# EAGLE design Selecta Pi Shield V1 (EAGLE 9.3.1)

## Sheet 1 of 3
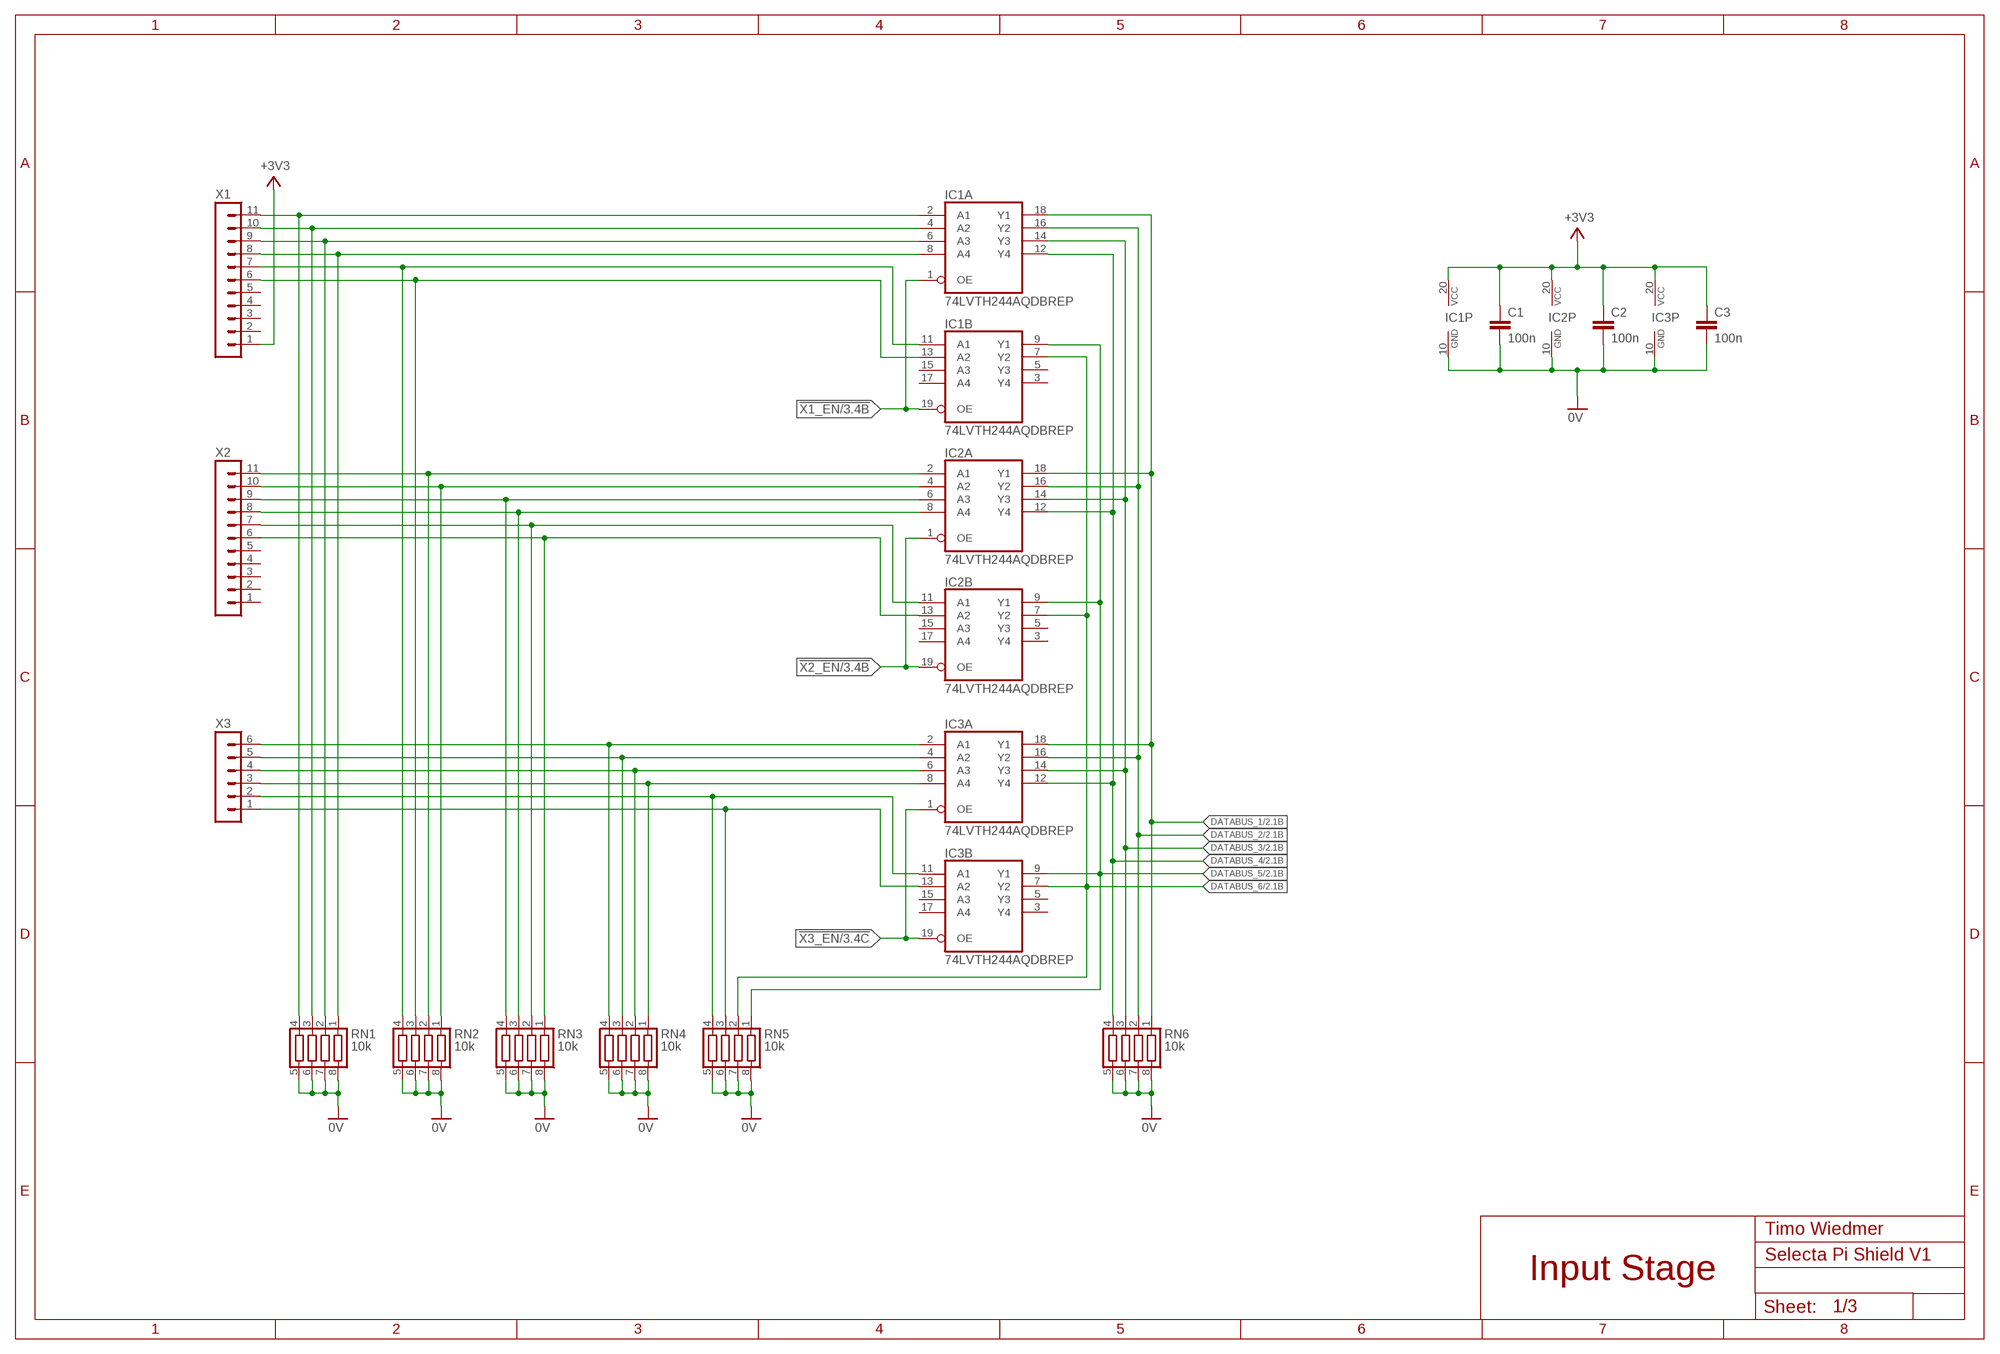
[diagram p0: schematic, sheet 1]

### Parts
C1  100n  C-EUC0603  [C0603]
C2  100n  C-EUC0603  [C0603]
C3  100n  C-EUC0603  [C0603]
IC1  74LVTH244AQDBREP  74244AQDBREP  [SSOP20]
IC2  74LVTH244AQDBREP  74244AQDBREP  [SSOP20]
IC3  74LVTH244AQDBREP  74244AQDBREP  [SSOP20]
RN1  10k  CTS742C083  [CTS742C083]
RN2  10k  CTS742C083  [CTS742C083]
RN3  10k  CTS742C083  [CTS742C083]
RN4  10k  CTS742C083  [CTS742C083]
RN5  10k  CTS742C083  [CTS742C083]
RN6  10k  CTS742C083  [CTS742C083]
X1  MA11-1  [MA11-1]
X2  MA11-1  [MA11-1]
X3  MA06-1  [MA06-1]

### Nets
0V: C1.2 C2.2 C3.2 IC1.10(P:GND) IC2.10(P:GND) IC3.10(P:GND) RN1.5 RN1.6 RN1.7 RN1.8 RN2.5 RN2.6 RN2.7 RN2.8 RN3.5 RN3.6 RN3.7 RN3.8 RN4.5 RN4.6 RN4.7 RN4.8 RN5.5 RN5.6 RN5.7 RN5.8 RN6.5 RN6.6 RN6.7 RN6.8 ; also sheet 2,3
!X1_EN: IC1.1(A:OE) IC1.19(B:OE) ; also sheet 3
!X2_EN: IC2.1(A:OE) IC2.19(B:OE) ; also sheet 3
!X3_EN: IC3.1(A:OE) IC3.19(B:OE) ; also sheet 3
+3V3: C1.1 C2.1 C3.1 IC1.20(P:VCC) IC2.20(P:VCC) IC3.20(P:VCC) X1.1 ; also sheet 3
DATABUS_1: IC1.18(A:Y1) IC2.18(A:Y1) IC3.18(A:Y1) RN6.1 ; also sheet 2,3
DATABUS_2: IC1.16(A:Y2) IC2.16(A:Y2) IC3.16(A:Y2) RN6.2 ; also sheet 2,3
DATABUS_3: IC1.14(A:Y3) IC2.14(A:Y3) IC3.14(A:Y3) RN6.3 ; also sheet 2,3
DATABUS_4: IC1.12(A:Y4) IC2.12(A:Y4) IC3.12(A:Y4) RN6.4 ; also sheet 2,3
DATABUS_5: IC1.9(B:Y1) IC2.9(B:Y1) IC3.9(B:Y1) RN5.1 ; also sheet 2,3
DATABUS_6: IC1.7(B:Y2) IC2.7(B:Y2) IC3.7(B:Y2) RN5.2 ; also sheet 2,3
N$1: IC1.2(A:A1) RN1.4 X1.11
N$2: IC1.4(A:A2) RN1.3 X1.10
N$3: IC1.6(A:A3) RN1.2 X1.9
N$4: IC1.8(A:A4) RN1.1 X1.8
N$5: IC2.2(A:A1) RN2.2 X2.11
N$6: IC2.4(A:A2) RN2.1 X2.10
N$7: IC2.6(A:A3) RN3.4 X2.9
N$8: IC2.8(A:A4) RN3.3 X2.8
N$9: IC3.2(A:A1) RN4.4 X3.6
N$10: IC3.4(A:A2) RN4.3 X3.5
N$11: IC1.11(B:A1) RN2.4 X1.7
N$12: IC1.13(B:A2) RN2.3 X1.6
N$13: IC2.11(B:A1) RN3.2 X2.7
N$14: IC3.6(A:A3) RN4.2 X3.4
N$15: IC2.13(B:A2) RN3.1 X2.6
N$16: IC3.8(A:A4) RN4.1 X3.3
N$17: IC3.11(B:A1) RN5.4 X3.2
N$18: IC3.13(B:A2) RN5.3 X3.1
Unconnected: IC1.3(B:Y4) IC1.5(B:Y3) IC1.15(B:A3) IC1.17(B:A4) IC2.3(B:Y4) IC2.5(B:Y3) IC2.15(B:A3) IC2.17(B:A4) IC3.3(B:Y4) IC3.5(B:Y3) IC3.15(B:A3) IC3.17(B:A4) X1.2 X1.3 X1.4 X1.5 X2.1 X2.2 X2.3 X2.4 X2.5

### Notes on the sheet
- Timo Wiedmer
- Input Stage

## Sheet 2 of 3
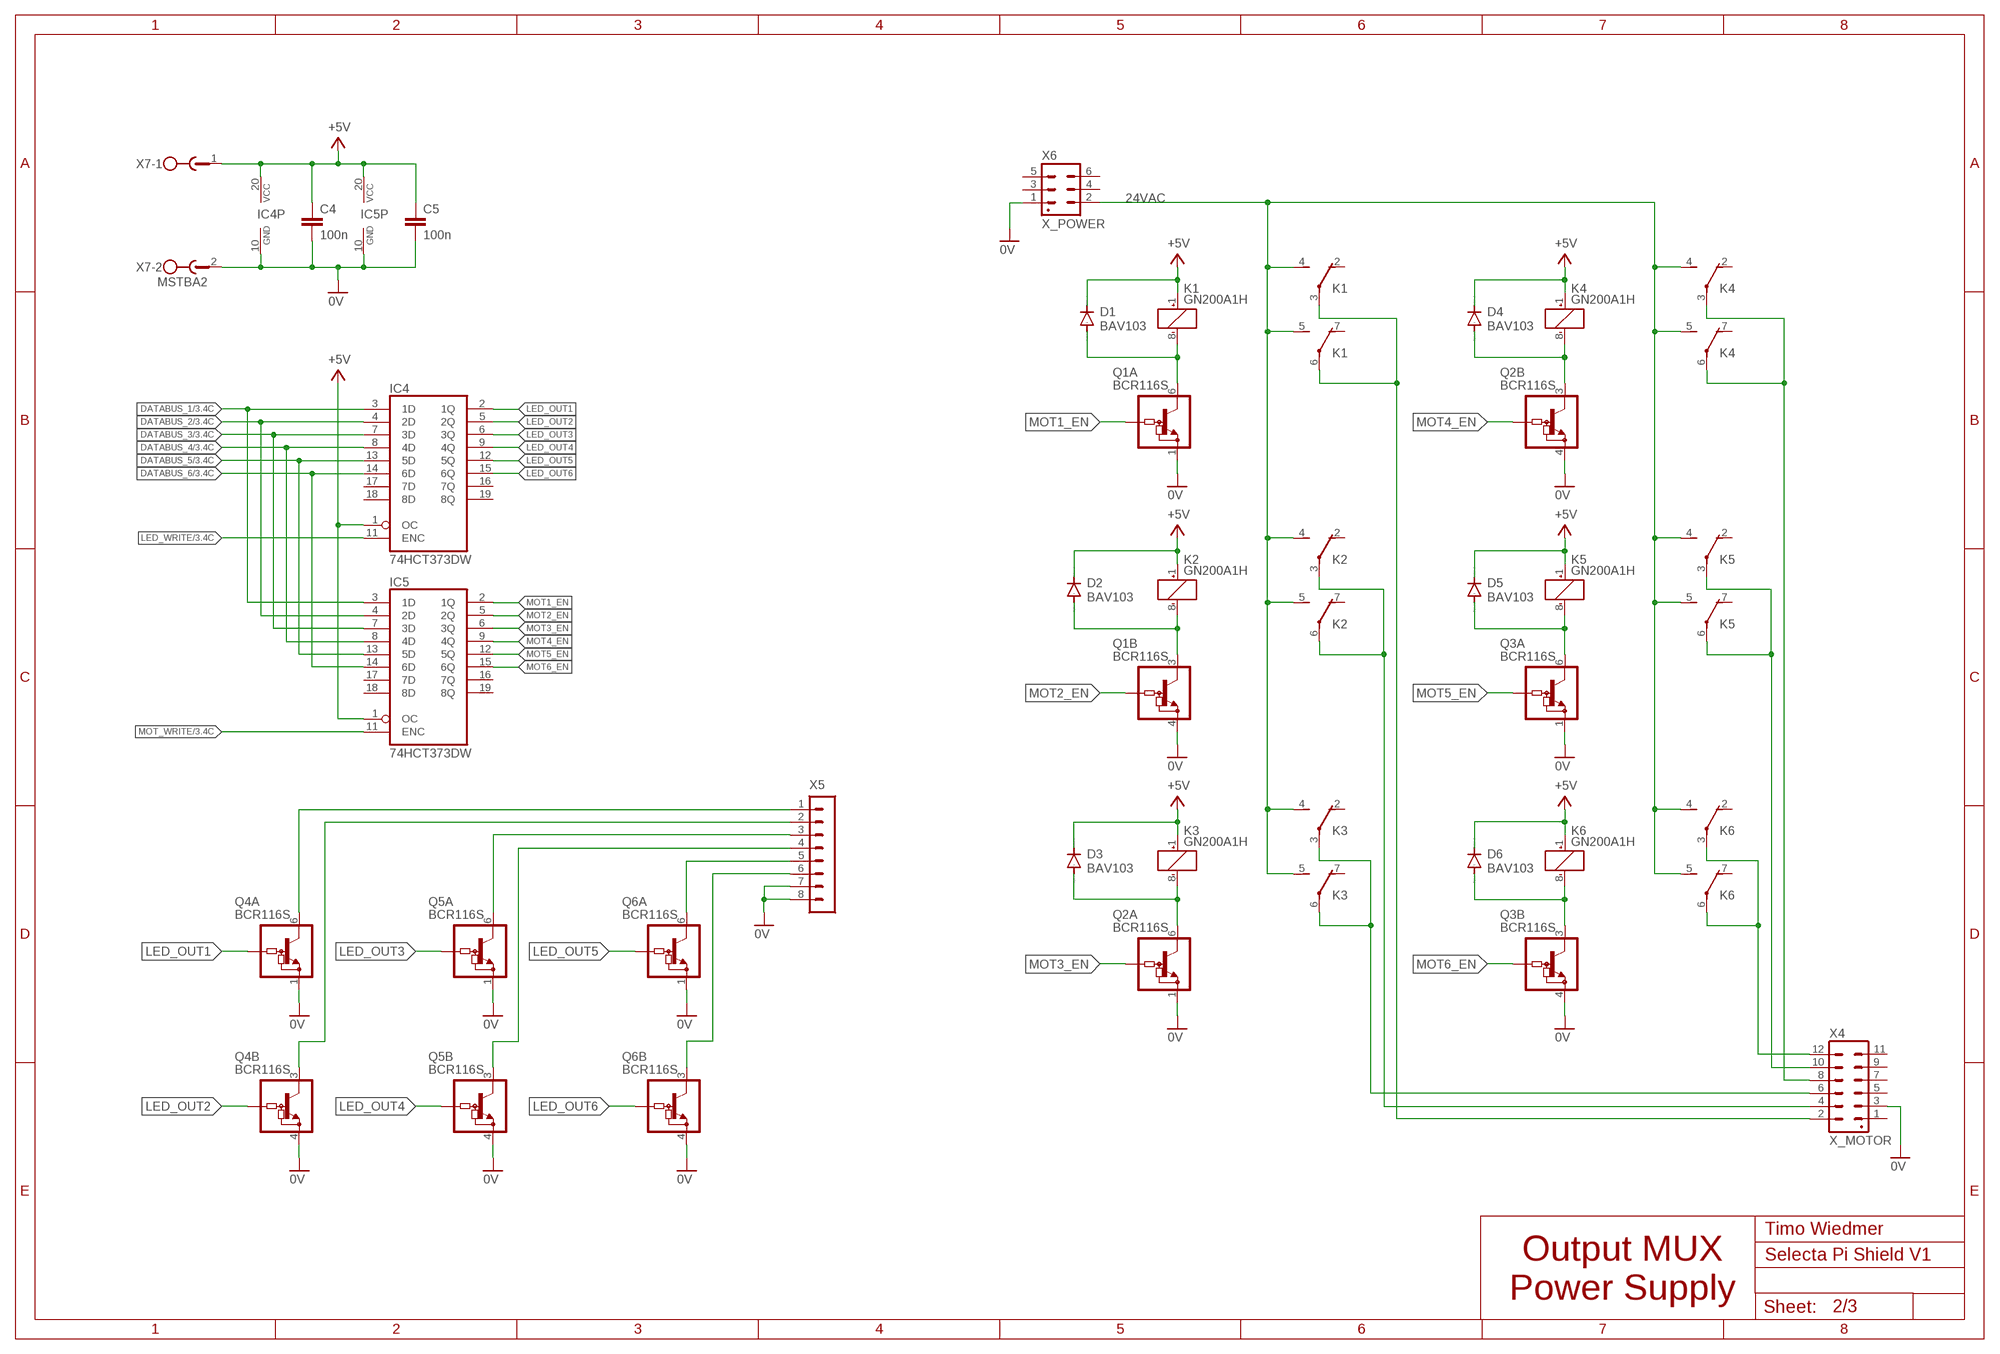
[diagram p1: schematic, sheet 2]

### Parts
C4  100n  C-EUC0603  [C0603]
C5  100n  C-EUC0603  [C0603]
D1  BAV103  [SOD-123_MINI-SMA]
D2  BAV103  [SOD-123_MINI-SMA]
D3  BAV103  [SOD-123_MINI-SMA]
D4  BAV103  [SOD-123_MINI-SMA]
D5  BAV103  [SOD-123_MINI-SMA]
D6  BAV103  [SOD-123_MINI-SMA]
IC4  74HCT373DW  [SO20W]
IC5  74HCT373DW  [SO20W]
K1  GN200A1H  [GN-A]
K2  GN200A1H  [GN-A]
K3  GN200A1H  [GN-A]
K4  GN200A1H  [GN-A]
K5  GN200A1H  [GN-A]
K6  GN200A1H  [GN-A]
Q1  BCR116S  [SOT363]
Q2  BCR116S  [SOT363]
Q3  BCR116S  [SOT363]
Q4  BCR116S  [SOT363]
Q5  BCR116S  [SOT363]
Q6  BCR116S  [SOT363]
X4  X_MOTOR  12P_MINI_FIT  [12P_MINI_FIT]
X5  MA08-1  [MA08-1]
X6  X_POWER  6P_MINI_FIT  [6P_MINI_FIT]
X7  MSTBA2  [MSTBA2]

### Nets
0V: C4.2 C5.2 IC4.10(GND) IC5.10(GND) Q1.1(A:E) Q1.4(B:E) Q2.1(A:E) Q2.4(B:E) Q3.1(A:E) Q3.4(B:E) Q4.1(A:E) Q4.4(B:E) Q5.1(A:E) Q5.4(B:E) Q6.1(A:E) Q6.4(B:E) X4.3 X5.7 X5.8 X6.1 X7.2 ; also sheet 1,3
24VAC: K1.4(S:S) K1.5(T:S) K2.4(S:S) K2.5(T:S) K3.4(S:S) K3.5(T:S) K4.4(S:S) K4.5(T:S) K5.4(S:S) K5.5(T:S) K6.4(S:S) K6.5(T:S) X6.2
24VAC_MOT1: K1.3(S:P) K1.6(T:P) X4.2
24VAC_MOT2: K2.3(S:P) K2.6(T:P) X4.4
24VAC_MOT3: K3.3(S:P) K3.6(T:P) X4.6
24VAC_MOT4: K4.3(S:P) K4.6(T:P) X4.8
24VAC_MOT5: K5.3(S:P) K5.6(T:P) X4.10
24VAC_MOT6: K6.3(S:P) K6.6(T:P) X4.12
+5V: C4.1 C5.1 D1.C D2.C D3.C D4.C D5.C D6.C IC4.1(OC) IC4.20(VCC) IC5.1(OC) IC5.20(VCC) K1.1(R:+) K2.1(R:+) K3.1(R:+) K4.1(R:+) K5.1(R:+) K6.1(R:+) X7.1 ; also sheet 3
DATABUS_1: IC4.3(1D) IC5.3(1D) ; also sheet 1,3
DATABUS_2: IC4.4(2D) IC5.4(2D) ; also sheet 1,3
DATABUS_3: IC4.7(3D) IC5.7(3D) ; also sheet 1,3
DATABUS_4: IC4.8(4D) IC5.8(4D) ; also sheet 1,3
DATABUS_5: IC4.13(5D) IC5.13(5D) ; also sheet 1,3
DATABUS_6: IC4.14(6D) IC5.14(6D) ; also sheet 1,3
LED_OUT1: IC4.2(1Q) Q4.2(A:B)
LED_OUT2: IC4.5(2Q) Q4.5(B:B)
LED_OUT3: IC4.6(3Q) Q5.2(A:B)
LED_OUT4: IC4.9(4Q) Q5.5(B:B)
LED_OUT5: IC4.12(5Q) Q6.2(A:B)
LED_OUT6: IC4.15(6Q) Q6.5(B:B)
LED_WRITE: IC4.11(ENC) ; also sheet 3
MOT1_EN: IC5.2(1Q) Q1.2(A:B)
MOT2_EN: IC5.5(2Q) Q1.5(B:B)
MOT3_EN: IC5.6(3Q) Q2.2(A:B)
MOT4_EN: IC5.9(4Q) Q2.5(B:B)
MOT5_EN: IC5.12(5Q) Q3.2(A:B)
MOT6_EN: IC5.15(6Q) Q3.5(B:B)
MOT_WRITE: IC5.11(ENC) ; also sheet 3
N$19: Q4.6(A:C) X5.1
N$26: Q4.3(B:C) X5.2
N$27: D3.A K3.8(R:-) Q2.6(A:C)
N$28: D6.A K6.8(R:-) Q3.3(B:C)
N$29: D5.A K5.8(R:-) Q3.6(A:C)
N$30: D2.A K2.8(R:-) Q1.3(B:C)
N$31: D1.A K1.8(R:-) Q1.6(A:C)
N$32: D4.A K4.8(R:-) Q2.3(B:C)
N$33: Q5.6(A:C) X5.3
N$34: Q5.3(B:C) X5.4
N$35: Q6.6(A:C) X5.5
N$36: Q6.3(B:C) X5.6
Unconnected: IC4.16(7Q) IC4.17(7D) IC4.18(8D) IC4.19(8Q) IC5.16(7Q) IC5.17(7D) IC5.18(8D) IC5.19(8Q) K1.2(S:O) K1.7(T:O) K2.2(S:O) K2.7(T:O) K3.2(S:O) K3.7(T:O) K4.2(S:O) K4.7(T:O) K5.2(S:O) K5.7(T:O) K6.2(S:O) K6.7(T:O) X4.1 X4.5 X4.7 X4.9 X4.11 X6.3 X6.4 X6.5 X6.6

### Notes on the sheet
- Timo Wiedmer
- Output MUX
  Power Supply

## Sheet 3 of 3
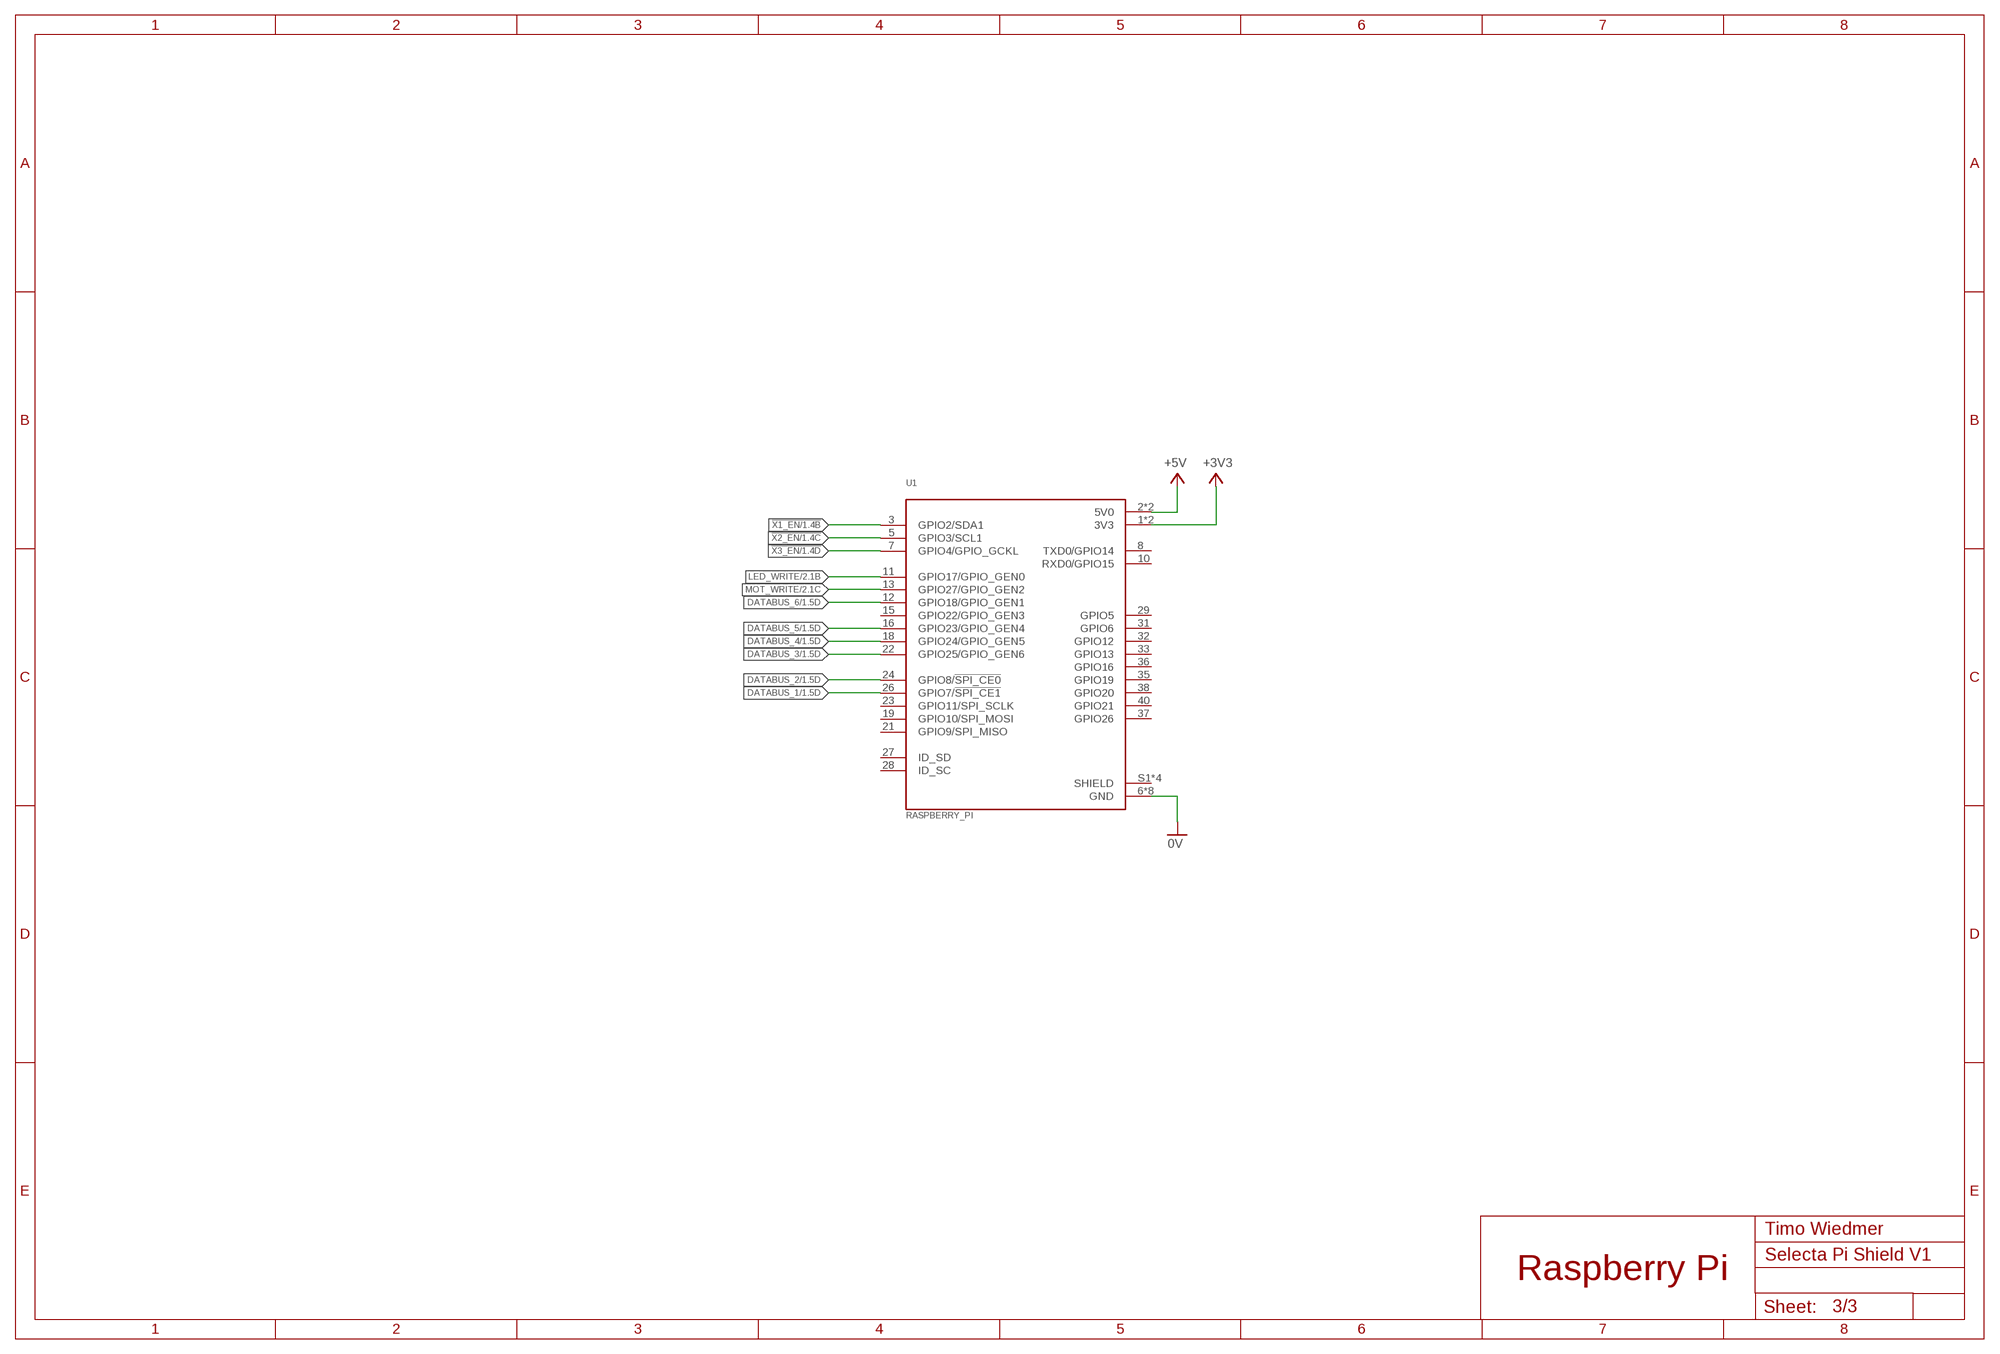
[diagram p2: schematic, sheet 3]

### Parts
U1  RASPBERRY_PI  [RASPBERRY_PI]

### Nets
0V: U1.6(GND) U1.9(GND) U1.14(GND) U1.20(GND) U1.25(GND) U1.30(GND) U1.34(GND) U1.39(GND) ; also sheet 1,2
!X1_EN: U1.3(GPIO2/SDA1) ; also sheet 1
!X2_EN: U1.5(GPIO3/SCL1) ; also sheet 1
!X3_EN: U1.7(GPIO4/GPIO_GCKL) ; also sheet 1
+3V3: U1.1(3V3) U1.17(3V3) ; also sheet 1
+5V: U1.2(5V0) U1.4(5V0) ; also sheet 2
DATABUS_1: U1.26(GPIO7/!SPI_CE1!) ; also sheet 1,2
DATABUS_2: U1.24(GPIO8/!SPI_CE0!) ; also sheet 1,2
DATABUS_3: U1.22(GPIO25/GPIO_GEN6) ; also sheet 1,2
DATABUS_4: U1.18(GPIO24/GPIO_GEN5) ; also sheet 1,2
DATABUS_5: U1.16(GPIO23/GPIO_GEN4) ; also sheet 1,2
DATABUS_6: U1.12(GPIO18/GPIO_GEN1) ; also sheet 1,2
LED_WRITE: U1.11(GPIO17/GPIO_GEN0) ; also sheet 2
MOT_WRITE: U1.13(GPIO27/GPIO_GEN2) ; also sheet 2
Unconnected: U1.8(TXD0/GPIO14) U1.10(RXD0/GPIO15) U1.15(GPIO22/GPIO_GEN3) U1.19(GPIO10/SPI_MOSI) U1.21(GPIO9/SPI_MISO) U1.23(GPIO11/SPI_SCLK) U1.27(ID_SD) U1.28(ID_SC) U1.29(GPIO5) U1.31(GPIO6) U1.32(GPIO12) U1.33(GPIO13) U1.35(GPIO19) U1.36(GPIO16) U1.37(GPIO26) U1.38(GPIO20) U1.40(GPIO21)

### Notes on the sheet
- Timo Wiedmer
- Raspberry Pi

## Power pins joined to a net without a drawn wire
SHIELD: U1.S1(SHIELD) U1.S2(SHIELD) U1.S3(SHIELD) U1.S4(SHIELD)

## Library data of the parts
C1-C5 = rcl:C-EU: CAPACITOR, European symbol; SPICEPREFIX: C
D1-D6 = Selecta Pi Shield Parts:BAV103
IC1-IC3 = Selecta Pi Shield Parts:74*244: Octal BUFFER and LINE DRIVER, 3-state
IC4 IC5 = 74xx-eu:74*373: Octal D type transparent LATCH, edge triggered
K1-K6 = relay:GN?*: ULTRA-SMALL PACKAGE SLIM POLARIZED RELAY NAiS Source: http://www.mew-europe.com/.. en_ds_61007_0000.pdf; OC_FARNELL: unknown; OC_NEWARK: unknown
Q1-Q6 = Selecta Pi Shield Parts:BCR116
RN1-RN6 = resistor-net:CTS742C083: Chip Resistor Array 4 Single Resistor Source: http://www.ctscorp.com/components/Datasheets/CTSChipArrayDs.pdf; OC_FARNELL: unknown; OC_NEWARK: unknown
U1 = Selecta Pi Shield Parts:RASPBERRY_PI: BCM2835 Raspberry Pi Model B+ - ARM11, VideoCore MPU Embedded Evaluation Board Check availability <https://pricing.snapeda.com/parts/RASPBERRY%20PI%203%20MODEL%20B%2B/Raspberry%20Pi/view-part?ref=eda>; AVAILABILITY: Not in stock; DESCRIPTION: RASPBERRY PI 3 MOD B+ BCM2837B0; MF: Raspberry Pi; MP: RASPBERRY PI 3 MODEL B+; PACKAGE: None; PRICE: None
X1 X2 = Selecta Pi Shield Parts:MA11-1
X3 = Selecta Pi Shield Parts:MA06-1: PIN HEADER; OC_FARNELL: unknown; OC_NEWARK: unknown
X4 = Selecta Pi Shield Parts:12P_MINI_FIT
X5 = Selecta Pi Shield Parts:MA08-1: PIN HEADER; OC_FARNELL: unknown; OC_NEWARK: unknown
X6 = Selecta Pi Shield Parts:6P_MINI_FIT
X7 = con-phoenix-508:MSTBA2: PHOENIX; MF: FARNELL; MPN: 1757242; OC_FARNELL: 3705171; OC_NEWARK: 71C4161

## Board
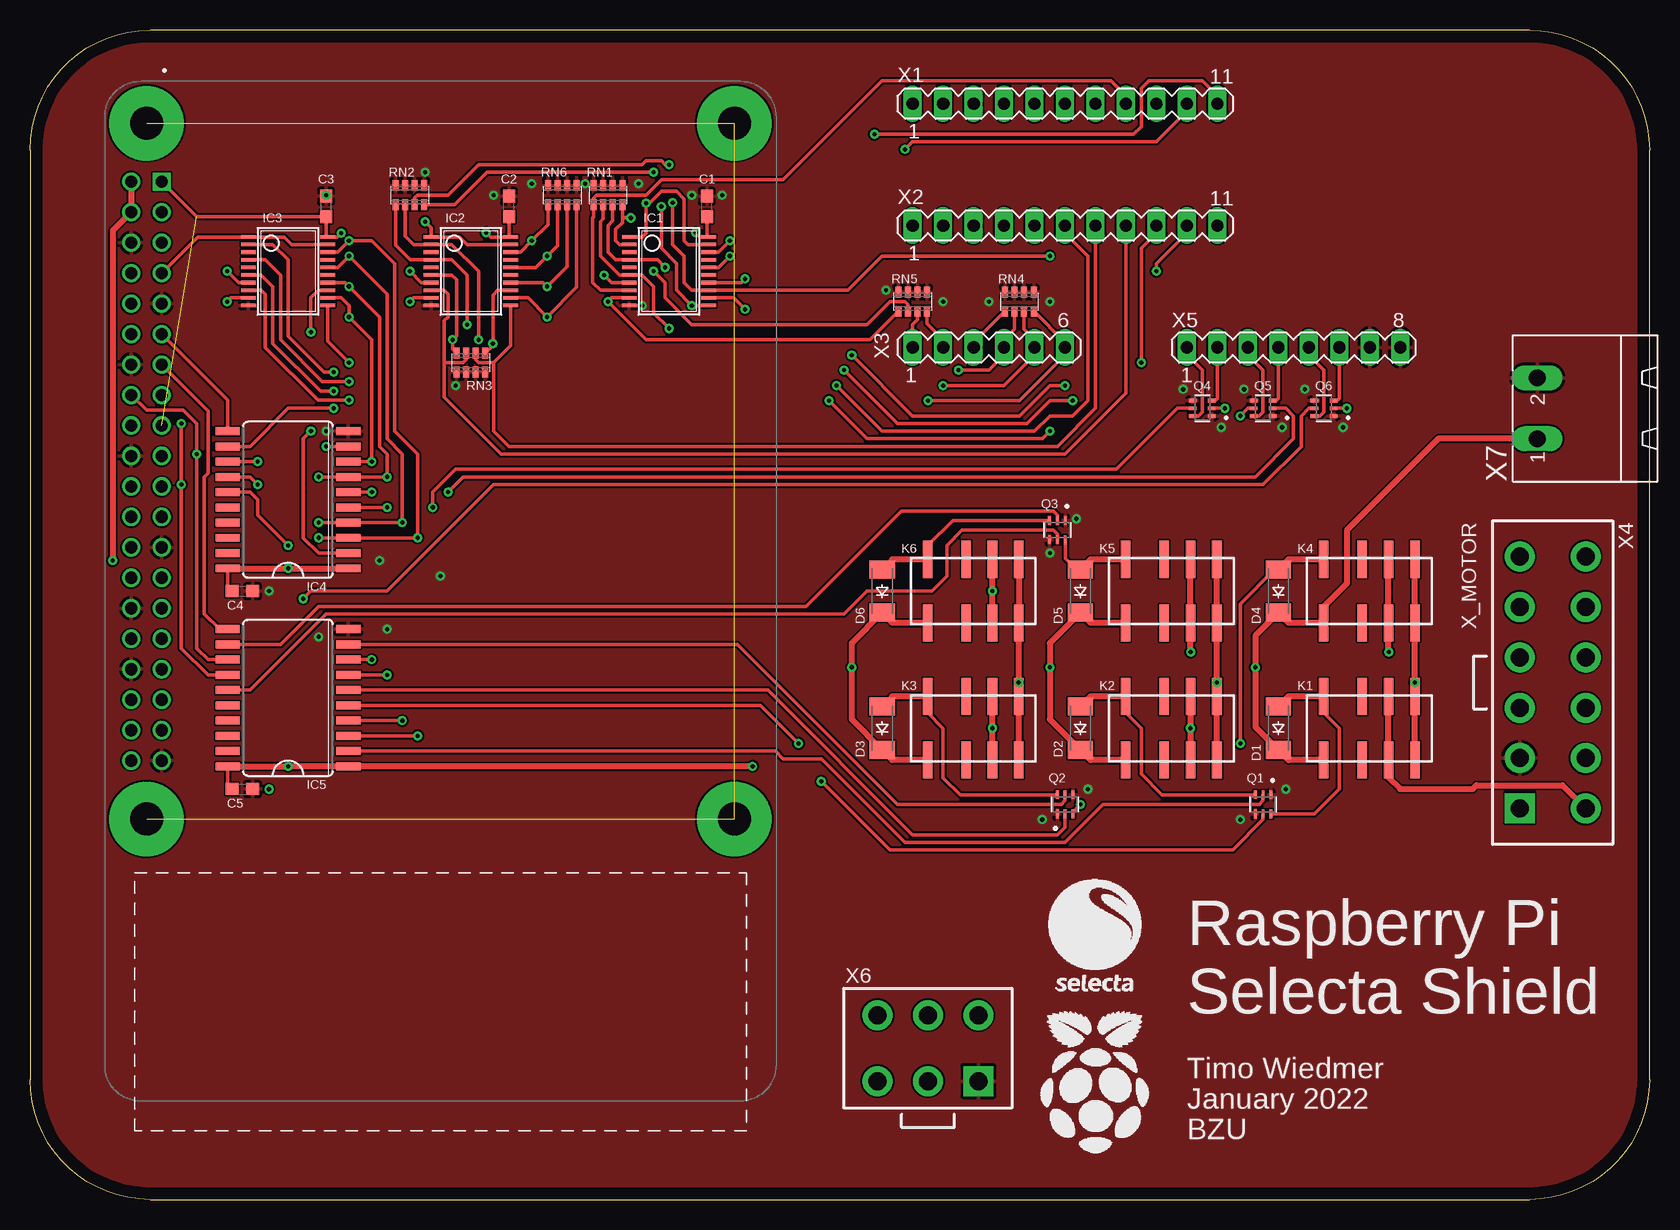
[diagram p3: board, top side]
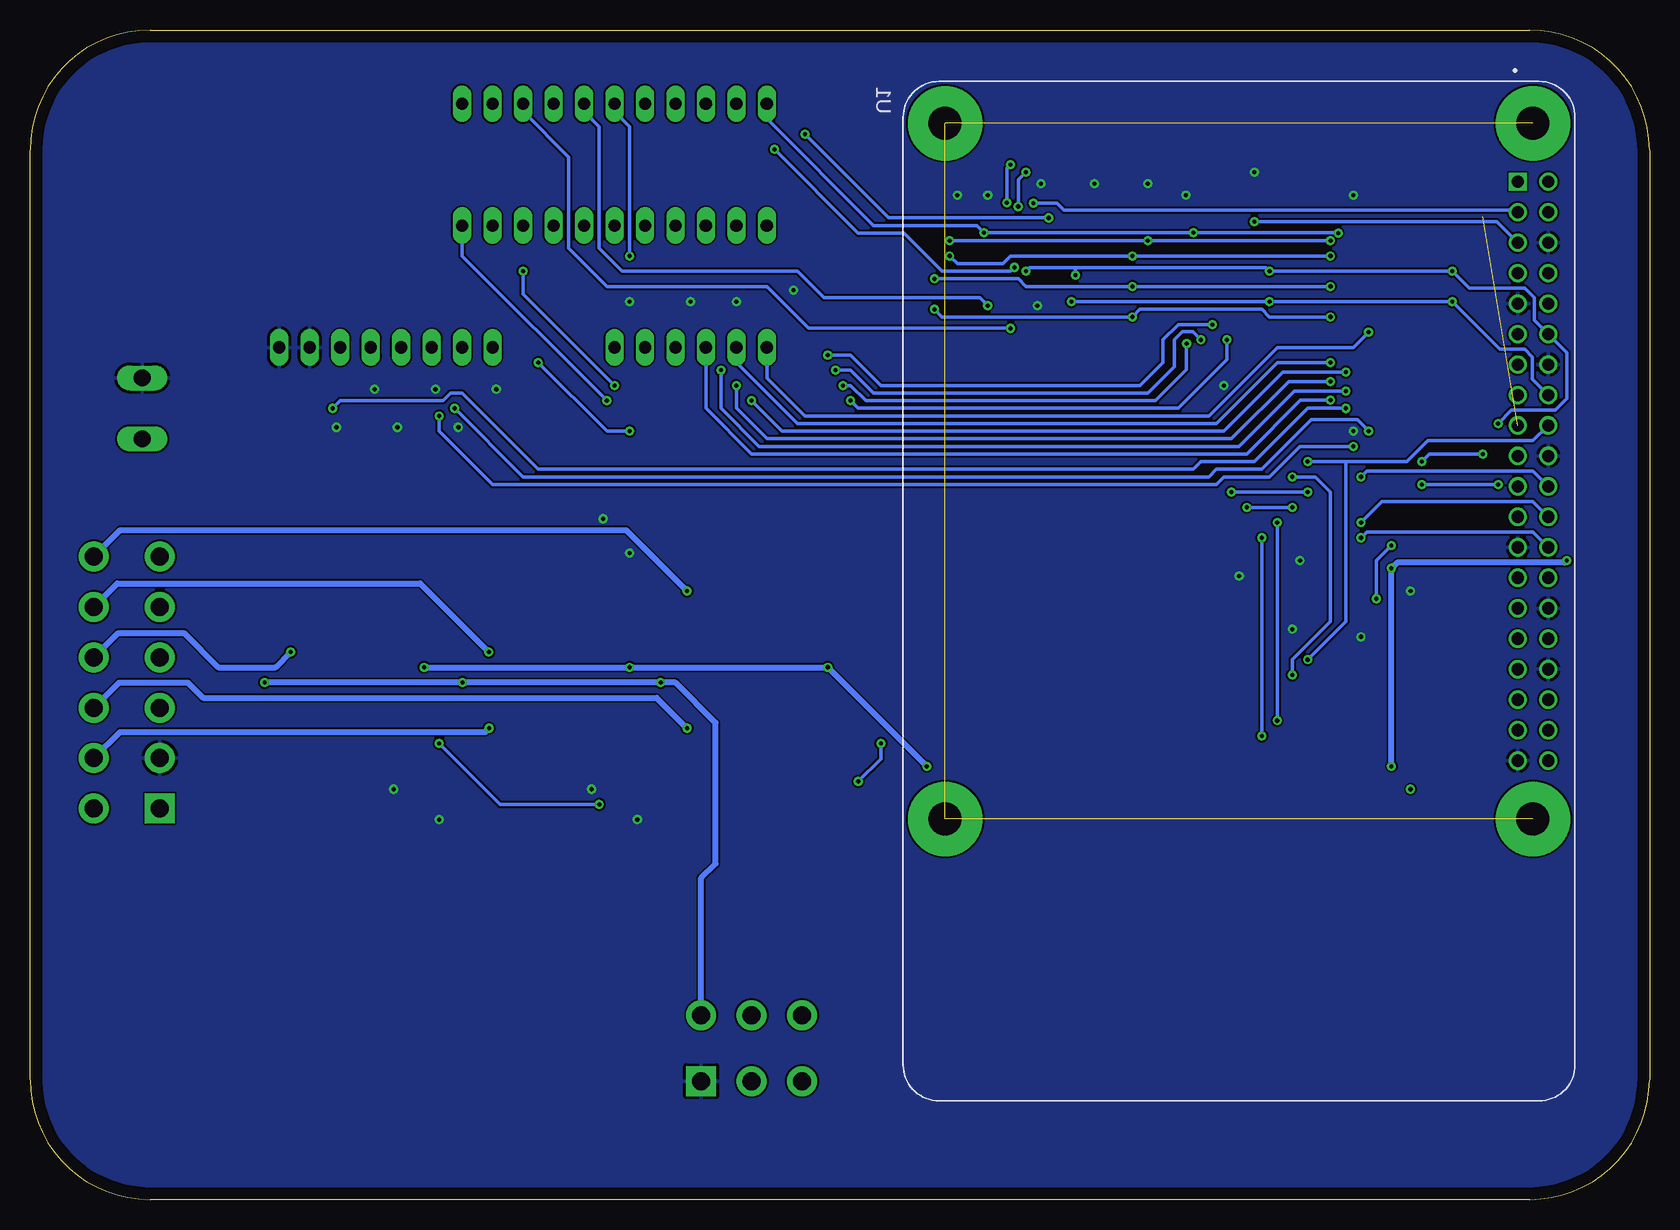
[diagram p4: board, bottom side, seen from below]

Size 135 x 97.5 mm. Coordinates in mm from the lower left corner, seen from the top.
Outline: 10,0 125,0 arc90 135,10 135,87.5 arc90 125,97.5 10,97.5 arc90 0,87.5 0,10 arc90 10,0
Copper layers (1*16): Top 0.035mm / dielectric 1.5mm / Bottom 0.035mm
Design rules "default *": minimum track width 6mil, minimum drill 0.35mm, track to track 6mil, track to pad 6mil, pad to pad 6mil, via to via 6mil, smd to smd 6mil, copper to edge 40mil, drill to drill 6mil, minimum pad ring 10mil, minimum via ring 8mil, stop-mask expansion 4mil, vias tented up to drill 0mil, thermal gap 10mil

### Footprints (pad centres in the part's own frame; a part is rotated, then mirrored left to right if it is on the bottom)
C0603 = smd 1.1 x 1: 1 -0.85,0; 2 0.85,0
SOD-123_MINI-SMA = smd 1.5 x 2.1: A 1.8,0; C -1.8,0
SSOP20 = smd 0.305 x 1.245: 1 -2.857,-3.302; 2 -2.222,-3.302; 3 -1.587,-3.302; 4 -0.952,-3.302; 5 -0.317,-3.302; 6 0.318,-3.302; 7 0.953,-3.302; 8 1.588,-3.302; 9 2.223,-3.302; 10 2.858,-3.302; 11 2.858,3.302; 12 2.223,3.302; 13 1.588,3.302; 14 0.953,3.302; 15 0.318,3.302; 16 -0.317,3.302; 17 -0.952,3.302; 18 -1.587,3.302; 19 -2.222,3.302; 20 -2.857,3.302
SO20W = smd 0.66 x 2.032: 1 -5.715,-5.029; 2 -4.445,-5.029; 3 -3.175,-5.029; 4 -1.905,-5.029; 5 -0.635,-5.029; 6 0.635,-5.029; 7 1.905,-5.029; 8 3.175,-5.029; 9 4.445,-5.029; 10 5.715,-5.029; 11 5.715,5.029; 12 4.445,5.029; 13 3.175,5.029; 14 1.905,5.029; 15 0.635,5.029; 16 -0.635,5.029; 17 -1.905,5.029; 18 -3.175,5.029; 19 -4.445,5.029; 20 -5.715,5.029
GN-A = smd 0.8 x 3.1: 1 -3.835,-2.65; 2 -0.635,-2.65; 3 1.565,-2.65; 4 3.765,-2.65; 5 3.765,2.65; 6 1.565,2.65; 7 -0.635,2.65; 8 -3.835,2.65
SOT363 = smd 0.7 x 0.3: 1 -0.8,0.65; 2 -0.8,0; 3 -0.8,-0.65; 4 0.8,-0.65; 5 0.8,0; 6 0.8,0.65
CTS742C083 = smd 0.5 x 0.9: 1 -1.2,-0.8; 2 -0.4,-0.8; 3 0.4,-0.8; 4 1.2,-0.8; 5 1.2,0.8; 6 0.4,0.8; 7 -0.4,0.8; 8 -1.2,0.8
RASPBERRY_PI = drill 1.016 square: 1 9.05,4.71 | drill 1.016: 2 9.05,2.17; 3 11.59,4.71; 4 11.59,2.17; 5 14.13,4.71; 6 14.13,2.17; 7 16.67,4.71; 8 16.67,2.17; 9 19.21,4.71; 10 19.21,2.17; 11 21.75,4.71; 12 21.75,2.17; 13 24.29,4.71; 14 24.29,2.17; 15 26.83,4.71; 16 26.83,2.17; 17 29.37,4.71; 18 29.37,2.17; 19 31.91,4.71; 20 31.91,2.17; 21 34.45,4.71; 22 34.45,2.17; 23 36.99,4.71; 24 36.99,2.17; 25 39.53,4.71; 26 39.53,2.17; 27 42.07,4.71; 28 42.07,2.17; 29 44.61,4.71; 30 44.61,2.17; 31 47.15,4.71; 32 47.15,2.17; 33 49.69,4.71; 34 49.69,2.17; 35 52.23,4.71; 36 52.23,2.17; 37 54.77,4.71; 38 54.77,2.17; 39 57.31,4.71; 40 57.31,2.17 | drill 2.75 pad 6.2: S1 4.18,3.44; S2 62.18,3.44; S3 62.18,52.44; S4 4.18,52.44
MA11-1 = drill 1.016 long: 1 -13.97,0; 2 -11.43,0; 3 -8.89,0; 4 -6.35,0; 5 -3.81,0; 6 -1.27,0; 7 1.27,0; 8 3.81,0; 9 6.35,0; 10 8.89,0; 11 11.43,0
MA06-1 = drill 1.016 long: 1 -6.35,0; 2 -3.81,0; 3 -1.27,0; 4 1.27,0; 5 3.81,0; 6 6.35,0
12P_MINI_FIT = drill 1.5 pad 2.5 square: 1 10.5,-2.75 | drill 1.5 pad 2.5: 2 10.5,2.75; 3 6.3,-2.75; 4 6.3,2.75; 5 2.1,-2.75; 6 2.1,2.75; 7 -2.1,-2.75; 8 -2.1,2.75; 9 -6.3,-2.75; 10 -6.3,2.75; 11 -10.5,-2.75; 12 -10.5,2.75
MA08-1 = drill 1.016 long: 1 -8.89,0; 2 -6.35,0; 3 -3.81,0; 4 -1.27,0; 5 1.27,0; 6 3.81,0; 7 6.35,0; 8 8.89,0
6P_MINI_FIT = drill 1.5 pad 2.5 square: 1 4.2,-2.75 | drill 1.5 pad 2.5: 2 4.2,2.75; 3 0,-2.75; 4 0,2.75; 5 -4.2,-2.75; 6 -4.2,2.75
MSTBA2 = drill 1.397 long: 1 -2.54,5.08; 2 2.54,5.08

### Placement (x,y rotation side)
C1  56.44,82.79 90 top
C2  39.92,82.79 90 top
C3  24.68,82.79 90 top
C4  17.7,50.72 0 top
C5  17.7,34.21 0 top
D1  104.06,39.29 90 top
D2  87.55,39.29 90 top
D3  71.04,39.29 90 top
D4  104.06,50.72 90 top
D5  87.55,50.72 90 top
D6  71.04,50.72 90 top
IC1  53.26,77.39 270 top
IC2  36.75,77.39 270 top
IC3  21.51,77.39 270 top
IC4  21.51,58.34 90 top
IC5  21.51,41.83 90 top
K1  111.68,39.29 0 top
K2  95.17,39.29 0 top
K3  78.66,39.29 0 top
K4  111.68,50.72 0 top
K5  95.17,50.72 0 top
K6  78.66,50.72 0 top
Q1  102.79,32.94 270 top
Q2  86.28,32.94 90 top
Q3  85.64,55.8 270 top
Q4  97.71,65.96 180 top
Q5  102.79,65.96 180 top
Q6  107.87,65.96 180 top
RN1  48.18,83.74 0 top
RN2  31.67,83.74 0 top
RN3  36.75,69.77 180 top
RN4  82.47,74.85 0 top
RN5  73.58,74.85 0 top
RN6  44.37,83.74 0 top
U1  6.27,93.9 270 top
U$1  [RASPBERRY_LOGO]  88.82,8.81 0 top
U$2  [SELECTA_LOGO]  88.82,22.78 0 top
X1  87.55,91.36 0 top
X2  87.55,81.2 0 top
X3  79.93,71.04 0 top
X4  126.92,43.1 270 top
X5  105.33,71.04 0 top
X6  74.85,12.62 0 top
X7  130.73,65.96 90 top

### Tracks (layer width: path | path; a pad name or v marks a point on that pad's centre or on a via)
0V  (via drill 0.35)
  other vias: 85.01,53.9 87.23,56.75 88.19,34.21 84.38,31.67 46.27,84.69 24.68,83.74 32.94,85.64 41.83,84.69 50.72,84.69 79.93,74.85 85.01,74.85 71.36,75.8 76.12,74.85 38.66,83.74 57.7,83.74 55.16,83.74 96.12,67.55 101.2,67.55 106.28,67.55 99.3,64.37 104.38,64.37 109.46,64.37 24.68,64.06 34.21,51.99 29.13,53.26 29.77,47.55 24.05,46.91 19.92,50.72 35.48,67.87 51.04,74.53 104.69,34.21 100.89,31.67
  pour Bottom: -0.08,97.71 134.54,97.71 134.54,-0.08 74.85,-0.08 -0.08,-0.08 -0.08,45.64
  pour Top: -0.08,97.71 134.54,97.71 134.54,-0.08 -0.08,-0.08
24VAC  (via drill 0.35)
  Top 0.5: K1.4 K1.5 v115.44,43.1 K4.4 K4.5 | K2.4 K2.5 v98.94,43.1 K5.4 K5.5 | K3.4 K3.5 v82.42,43.1 K6.4 K6.5
  Bottom 0.5: v115.44,43.1 v98.94,43.1 v82.42,43.1 81.2,43.1 77.85,39.75 77.85,28 79.05,26.8 X6.2
24VAC_MOT1
  Top 0.5: K1.6 K1.3 113.25,35.19 114.22,34.21 120.25,34.21 120.57,34.53 127.74,34.53 X4.2
24VAC_MOT2  (via drill 0.35)
  Top 0.5: K2.6 v96.73,39.29 K2.3
  Bottom 0.5: X4.4 127.5,38.97 97.05,38.97 v96.73,39.29
24VAC_MOT3  (via drill 0.35)
  Top 0.5: K3.3 v80.22,39.29 K3.6
  Bottom 0.5: v80.22,39.29 82.77,41.83 120.57,41.83 121.84,43.1 127.57,43.1 X4.6
24VAC_MOT4  (via drill 0.35)
  Top 0.5: K4.6 K4.3 113.25,45.66 v113.27,45.64
  Bottom 0.5: v113.27,45.64 114.54,44.37 119.3,44.37 122.16,47.23 127.64,47.23 X4.8
24VAC_MOT5  (via drill 0.35)
  Top 0.5: K5.6 K5.3 96.73,45.66 v96.76,45.64
  Bottom 0.5: X4.10 127.72,51.35 102.47,51.35 v96.76,45.64
24VAC_MOT6  (via drill 0.35)
  Top 0.5: K6.3 v80.22,50.72 K6.6
  Bottom 0.5: X4.12 127.47,55.8 85.31,55.8 v80.22,50.72
!X1_EN  (via drill 0.35)
  Top 0.3: IC1.19 54.85,79.61 54.53,79.93 54.53,83.41 53.88,84.06 52.62,84.06 51.63,83.06 v51.35,83.06 51.35,80.56 51.04,80.25 IC1.1
  Bottom 0.3: v51.35,83.06 49.4,83.06 48.81,82.47 11.14,82.47 U1.3
!X2_EN  (via drill 0.35)
  Top 0.3: v32.94,81.52 33.45,81.01 IC2.1 35.8,80.25 36.43,79.61 IC2.19
  Bottom 0.3: U1.5 12.73,81.52 v32.94,81.52
!X3_EN
  Top 0.3: U1.7 14,80.25 IC3.1 21.19,80.25 21.83,79.61 IC3.19
+3V3  (via drill 0.35)  (1 unrouted)
  Top 0.3: C1.1 56.44,80.37 IC1.20 55.85,80.25 v55.48,80.61 | v38.02,80.61 38.38,80.25 39.92,80.25 | 39.92,80.25 IC2.20 | C2.1 39.92,80.25 | v25.95,80.57 25.62,80.25 IC3.20 24.68,80.37 C3.1 13.89,81.94 U1.1
  Bottom 0.3: v25.95,80.57 25.98,80.61 v38.02,80.61 v55.48,80.61 56.07,81.2 64.69,81.2 73.58,90.09 X1.1
+5V  (via drill 0.35)
  Top 0.3: C5.1 16.48,34.58 IC5.20 | C4.1 16.48,51.09 IC4.20
  Top 0.5: K6.1 71.89,48.07 D6.C 68.5,46.38 v68.5,44.37 68.5,40.03 D3.C 71.89,36.64 K3.1 | K5.1 88.4,48.07 D5.C 85.01,46.38 v85.01,44.37 85.01,40.03 D2.C 88.4,36.64 K2.1 | K1.1 104.91,36.64 D1.C 102.16,39.4 v102.16,44.37 102.16,47.02 D4.C 104.91,48.07 K4.1 107.84,49.42 109.78,51.35 109.78,55.8 117.39,63.42 X7.1 | IC5.20 v21.51,36.11 IC5.1 v60.24,36.11 | IC4.20 v21.51,52.62 IC4.1 | U1.2 U1.4 6.91,80.78 v6.91,53.26
  Bottom 0.5: v102.16,44.37 v85.01,44.37 v68.5,44.37 v60.24,36.11 | v21.51,36.11 v21.51,52.62 21.03,53.1 7.06,53.1 v6.91,53.26
DATABUS_1  (via drill 0.35)
  Top 0.3: IC3.18 25.64,78.98 v26.59,79.93 28.5,79.93 30.4,78.03 30.4,64.06 32.3,62.15 v32.3,55.16 IC4.3 v24.05,55.16 | IC2.18 40.88,78.98 v41.83,79.93 43.17,81.27 RN6.1 | IC1.18 57.39,78.98 v58.34,79.93 | v32.3,38.66 IC5.3
  Bottom 0.3: v58.34,79.93 v41.83,79.93 v26.59,79.93 | v32.3,55.16 v32.3,38.66 | U1.26 9.71,55.64 23.57,55.64 v24.05,55.16
DATABUS_2  (via drill 0.35)
  Top 0.3: IC3.16 25.64,77.71 v26.59,78.66 29.77,75.48 29.77,63.42 31.04,62.15 v31.04,56.44 IC4.4 v24.05,56.44 | IC2.16 42.15,77.71 v43.1,78.66 43.97,79.53 RN6.2 | IC1.16 57.39,77.71 v58.34,78.66 | IC5.4 v31.04,39.92
  Bottom 0.3: v26.59,78.66 v43.1,78.66 53.26,78.66 53.9,78.03 57.7,78.03 v58.34,78.66 | v31.04,39.92 v31.04,56.44 | U1.24 9.71,58.18 22.3,58.18 v24.05,56.44
DATABUS_3  (via drill 0.35)
  Top 0.3: IC3.14 26.27,76.44 v26.59,76.12 29.13,73.58 29.13,62.78 29.77,62.15 v29.77,60.24 IC4.7 v24.05,60.24 | IC2.14 42.78,76.44 v43.1,76.12 44.77,77.79 RN6.3 | IC1.14 59.29,76.44 v59.61,76.75 | IC5.7 v29.77,43.73
  Bottom 0.3: v26.59,76.12 v43.1,76.12 51.99,76.12 52.62,76.75 v59.61,76.75 | v29.77,43.73 29.77,45.01 26.59,48.18 26.59,58.98 27.86,60.24 v29.77,60.24 | U1.22 9.71,60.72 23.57,60.72 v24.05,60.24
DATABUS_4  (via drill 0.35)
  Top 0.3: IC3.12 25.96,75.17 26.59,74.53 v26.59,73.58 28.5,71.67 v28.5,61.52 IC4.8 | IC2.12 41.51,75.17 v43.1,73.58 45.57,76.05 RN6.4 | IC1.12 58.66,75.17 v59.61,74.22 | v28.5,45.01 IC5.8
  Bottom 0.3: v59.61,74.22 58.98,73.58 v43.1,73.58 42.47,74.22 32.3,74.22 31.67,73.58 v26.59,73.58 | v28.5,61.52 25.32,61.52 | 25.32,61.52 25.32,48.18 v28.5,45.01 | U1.18 9.71,63.26 18.49,63.26 20.24,61.52 25.32,61.52
DATABUS_5  (via drill 0.35)
  Top 0.3: IC2.9 31.99,75.17 v31.67,74.85 | v16.43,74.85 16.75,75.17 IC3.9 | IC1.9 48.5,75.17 v48.18,74.85 51.35,71.67 70,71.67 RN5.1 | IC5.13 14.84,45.01 13.89,45.96 v13.89,62.15 13.89,64.69 12.78,65.8 9.71,65.8 U1.16 | v18.97,61.52 IC4.13
  Bottom 0.3: v48.18,74.85 v31.67,74.85 v16.43,74.85 12.46,70.88 10.4,70.88 9.76,70.25 9.76,68.39 U1.16 | v13.89,62.15 18.34,62.15 v18.97,61.52
DATABUS_6  (via drill 0.35)
  Top 0.3: IC2.7 32.62,76.44 v31.67,77.39 | IC3.7 17.38,76.44 v16.43,77.39 | IC5.14 14.84,43.73 12.62,45.96 v12.62,59.61 v12.62,64.69 | v18.97,59.61 18.34,60.24 IC4.14 | RN5.2 73.18,74.61 72.94,74.85 71.67,74.85 69.77,72.94 55.16,72.94 52.94,75.17 52.94,76.44 v51.99,77.39 | IC1.7 48.5,76.44 v47.86,77.07
  Bottom 0.3: v51.99,77.39 51.67,77.71 47.86,77.71 | 47.86,77.71 31.99,77.71 v31.67,77.39 v16.43,77.39 15,75.96 10.4,75.96 9.6,75.17 9.6,73.31 U1.12 6.91,70.61 6.91,66.75 7.86,65.8 11.51,65.8 v12.62,64.69 | v12.62,59.61 v18.97,59.61 | v47.86,77.07 47.86,77.71
LED_OUT1  (via drill 0.35)
  Top 0.3: v99.61,65.96 Q4.2 | IC4.2 24.05,53.9 22.78,55.16 22.78,63.42 v23.41,64.06
  Bottom 0.3: v23.41,64.06 24.37,65.01 28.18,65.01 32.3,60.88 36.11,60.88 36.75,60.24 93.9,60.24 v99.61,65.96
LED_OUT2  (via drill 0.35)
  Top 0.3: IC4.5 v29.77,57.7 | Q4.5 95.64,65.96 90.56,60.88 35.48,60.88 33.58,58.98 v33.58,57.7
  Bottom 0.3: v33.58,57.7 v29.77,57.7
LED_OUT3  (via drill 0.35)
  Top 0.3: IC4.6 v28.5,58.98 | v34.84,58.98 36.11,60.24 102.16,60.24 105.33,63.42 105.33,65.33 104.69,65.96 Q5.2
  Bottom 0.3: v28.5,58.98 v34.84,58.98
LED_OUT4  (via drill 0.35)
  Top 0.3: IC4.9 v24.68,62.78 | v100.89,65.33 101.52,65.96 Q5.5
  Bottom 0.3: v24.68,62.78 29.13,62.78 31.67,60.24 35.48,60.24 36.11,59.61 96.44,59.61 100.89,64.06 v100.89,65.33
LED_OUT5  (via drill 0.35)
  Top 0.3: IC4.12 18.34,62.78 21.51,65.96 v25.32,65.96 | v109.78,65.96 Q6.2
  Bottom 0.3: v25.32,65.96 28.5,65.96 32.94,61.52 37.38,61.52 38.02,60.88 92.63,60.88 98.98,67.23 99.93,67.23 100.57,66.59 109.14,66.59 v109.78,65.96
LED_OUT6  (via drill 0.35)
  Top 0.3: Q6.5 106.6,65.96 105.97,65.33 105.97,62.78 102.79,59.61 38.66,59.61 29.77,50.72 23.41,50.72 v22.78,50.09 | v21.51,54.53 18.97,57.07 18.97,58.34 18.34,58.98 IC4.15
  Bottom 0.3: v22.78,50.09 22.78,53.26 v21.51,54.53
LED_WRITE
  Top 0.3: U1.11 16.48,66.65 IC4.11
MOT1_EN
  Top 0.3: Q1.2 102.79,33.26 102.47,32.94 89.45,32.94 86.28,29.77 72.94,29.77 65.96,36.75 62.78,36.75 62.15,37.38 IC5.2
MOT2_EN  (via drill 0.35)
  Top 0.3: Q1.5 102.79,31.67 100.25,29.13 71.67,29.13 v65.96,34.84 | v64.06,38.02 60.88,41.2 IC5.5
  Bottom 0.3: v65.96,34.84 64.06,36.75 v64.06,38.02
MOT3_EN
  Top 0.3: IC5.6 61.52,42.47 73.58,30.4 85.64,30.4 86.28,31.04 Q2.2
MOT4_EN
  Top 0.3: IC5.9 58.98,46.27 72.31,32.94 85.96,32.94 86.28,33.26 Q2.5
MOT5_EN
  Top 0.3: Q3.2 85.64,57.07 85.33,57.39 72.63,57.39 64.69,49.45 24.05,49.45 20.88,46.27 IC5.12
MOT6_EN
  Top 0.3: IC5.15 18.34,42.47 24.68,48.81 67.87,48.81 69.77,50.72 75.17,50.72 76.44,51.99 76.44,54.53 77.71,55.8 85.33,55.8 85.64,55.48 Q3.5
MOT_WRITE
  Top 0.3: IC5.11 15.79,47.55 14.53,48.81 14.53,60.24 14.84,60.56 14.84,65.75 U1.13
N$1  (via drill 0.35)
  Top 0.3: RN1.4 49.38,81.83 | 49.38,81.83 49.38,81.45 48.81,80.88 48.81,79.93 49.13,79.61 IC1.2 | v50.09,81.83 49.38,81.83 | v70.41,88.82 92,88.82 92.63,89.45 92.63,92.63 93.27,93.27 97.71,93.27 98.98,92 X1.11
  Bottom 0.3: v50.09,81.83 63.42,81.83 v70.41,88.82
N$2  (via drill 0.35)
  Top 0.3: RN1.3 48.58,81.6 48.18,81.2 48.18,78.98 48.82,78.34 IC1.4 52.31,78.34 v52.94,77.71 | v72.94,87.55 73.58,88.19 93.9,88.19 96.44,90.72 X1.10
  Bottom 0.3: v52.94,77.71 53.26,77.39 58.98,77.39 62.15,80.56 65.96,80.56 v72.94,87.55
N$3  (via drill 0.35)
  Top 0.3: RN1.2 47.78,81.75 47.55,81.52 47.55,78.66 49.13,77.07 IC1.6 51.04,77.07 51.99,76.12 51.99,73.9 v53.26,72.63
  Bottom 0.3: v53.26,72.63 70.09,72.63 73.58,76.12 86.92,76.12 90.09,79.3 90.09,86.92 93.9,90.72 X1.9
N$4
  Top 0.3: IC1.8 47.55,75.8 46.91,76.44 46.91,81.83 46.98,81.91 RN1.1 46.98,83.49 47.23,83.74 51.35,83.74 52.62,85.01 62.78,85.01 71.04,93.27 90.09,93.27 91.36,92 X1.8
N$5  (via drill 0.35)
  Top 0.3: RN2.2 31.27,80.33 31.99,79.61 IC2.2 35.16,79.61 37.38,77.39 v37.38,71.67 | v86.92,66.59 85.01,66.59 83.11,64.69 72.31,64.69 v67.87,69.14
  Bottom 0.3: v37.38,71.67 38.07,72.36 38.93,72.36 39.61,71.67 39.61,69.45 41.83,67.23 64.69,67.23 66.59,69.14 v67.87,69.14 | v86.92,66.59 98.98,78.66 X2.11
N$6  (via drill 0.35)
  Top 0.3: RN2.1 30.47,79.54 31.67,78.34 IC2.4 35.16,78.34 36.43,77.07 v36.43,72.94 | X2.10 96.44,80.56 93.9,78.03 v93.9,77.39 | v68.5,70.41 73.58,65.33 82.47,65.33 85.01,67.87 v86.28,67.87
  Bottom 0.3: v36.43,72.94 39.29,72.94 40.56,71.67 40.56,69.77 42.47,67.87 64.06,67.87 66.59,70.41 v68.5,70.41 | v86.28,67.87 93.9,75.48 v93.9,77.39
N$7  (via drill 0.35)
  Top 0.3: RN3.4 35.23,70.89 v35.23,71.67 35.55,71.99 35.55,76.69 35.16,77.07 IC2.6 | v66.59,66.59 69.77,63.42 84.38,63.42 v85.01,64.06 | v92.63,69.77 92.63,79.3 93.9,80.56 X2.9
  Bottom 0.3: v35.23,71.67 35.23,70.02 39.29,65.96 65.96,65.96 v66.59,66.59 | v85.01,64.06 86.92,64.06 v92.63,69.77
N$8
  Top 0.3: RN3.3 36.35,70 36.11,69.77 34.53,69.77 | IC2.8 34.53,75.8 34.84,75.48 34.84,73.58 34.53,73.26 34.53,69.77 | IC2.8 | 34.53,69.77 34.53,66.91 39.29,62.15 86.28,62.15 91.36,67.23 X2.8
N$9  (via drill 0.35)
  Top 0.3: RN4.4 86.28,71.44 X3.6 86.28,70.41 82.47,66.59 v74.85,66.59 | v25.32,68.98 24.53,68.98 21.51,71.99 21.51,78.34 20.24,79.61 IC3.2
  Bottom 0.3: v74.85,66.59 72.31,64.06 35.48,64.06 30.56,68.98 v25.32,68.98
N$10  (via drill 0.35)
  Top 0.3: RN4.3 82.87,72.55 83.74,71.67 X3.5 83.74,70.41 81.2,67.87 v76.12,67.87 | v26.59,68.18 24.37,68.18 20.88,71.67 20.88,77.07 19.61,78.34 IC3.4
  Bottom 0.3: v76.12,67.87 76.12,65.96 73.58,63.42 34.84,63.42 30.08,68.18 v26.59,68.18
N$11  (via drill 0.35)
  Top 0.3: IC1.11 v55.17,74.53 v55.16,74.53 53.9,75.8 53.9,78.03 52.62,79.3 v52.62,82.79 | RN2.4 35.41,82.94 38.12,85.64 v51.99,85.64
  Bottom 0.3: v51.99,85.64 52.62,85.01 v52.62,82.79 | v55.16,74.53 55.8,75.17 68.82,75.17 71.04,77.39 85.64,77.39 87.55,79.3 87.55,89.45 88.82,90.72 X1.7
N$12  (via drill 0.35)
  Top 0.3: RN2.3 32.07,83.5 32.3,83.74 34.84,83.74 37.38,86.28 51.04,86.28 51.35,86.6 52.62,86.6 52.94,86.28 v53.26,86.28 | v53.58,83.11 53.58,79.61 54.53,78.66 54.53,76.44 55.17,75.8 IC1.13 68.18,75.8 71.04,78.66 v85.01,78.66
  Bottom 0.3: v53.26,86.28 53.58,85.96 v53.58,83.11 | v85.01,78.66 85.01,89.45 86.28,90.72 X1.6
N$13
  Top 0.3: RN3.2 37.15,70 37.38,69.77 38.66,69.77 | 38.66,69.77 40.05,71.17 IC2.11 | X2.7 88.82,65.96 85.64,62.78 39.92,62.78 38.66,64.06 38.66,69.77
N$14  (via drill 0.35)
  Top 0.3: RN4.2 82.07,72.55 81.2,71.67 X3.4 81.2,70.41 79.93,69.14 v77.39,69.14 | v25.32,67.39 24.21,67.39 20.24,71.36 20.24,76.12 19.29,77.07 IC3.6
  Bottom 0.3: v77.39,69.14 77.39,65.96 74.22,62.78 34.21,62.78 29.61,67.39 v25.32,67.39
N$15  (via drill 0.35)
  Top 0.3: RN3.1 38.59,71.2 v38.59,71.36 38.59,75.42 38.97,75.8 IC2.13 | X2.6 86.28,80.56 88.19,78.66 88.19,66.59 86.92,65.33 85.01,65.33 83.74,64.06 71.04,64.06 v67.23,67.87
  Bottom 0.3: v38.59,71.36 38.59,69.2 41.2,66.59 65.33,66.59 66.59,67.87 v67.23,67.87
N$16  (via drill 0.35)
  Top 0.3: RN4.1 78.66,71.44 X3.3 | IC3.8 19.29,75.8 19.61,75.48 19.61,71.04 24,66.64 v26.59,66.64
  Bottom 0.3: v26.59,66.64 29.08,66.64 33.58,62.15 74.85,62.15 78.66,65.96 X3.3
N$17  (via drill 0.35)
  Top 0.3: RN5.4 74.78,73.02 76.12,71.67 X3.2 | IC3.11 24.81,71.55 v26.59,69.77
  Bottom 0.3: X3.2 76.12,69.77 71.04,64.69 36.11,64.69 31.04,69.77 v26.59,69.77
N$18  (via drill 0.35)
  Top 0.3: RN5.3 73.98,73.34 73.58,72.94 X3.1 | v23.41,72.31 23.41,75.17 24.05,75.8 IC3.13
  Bottom 0.3: X3.1 73.58,68.5 70.41,65.33 36.75,65.33 31.04,71.04 24.68,71.04 v23.41,72.31
N$19
  Top 0.3: Q4.6 97.38,65.31 97.71,65.64 97.71,69.14 96.44,70.41 X5.1
N$26
  Top 0.3: Q4.3 98.83,66.61 98.98,66.76 X5.2
N$27
  Top 0.3: K3.8 74.83,40.59 76.12,39.29 76.12,35.16 77.54,33.74 Q2.6
  Top 0.5: K3.8 71.89,41.94 D3.A
N$28
  Top 0.3: Q3.3 76.92,56.6 74.83,54.51 K6.8
  Top 0.5: K6.8 71.89,53.37 D6.A
N$29
  Top 0.3: Q3.6 86.3,53.46 87.23,52.52 D5.A
  Top 0.5: K5.8 88.4,53.37 D5.A
N$30
  Top 0.3: K2.8 91.36,41.91 91.36,40.56 92.63,39.29 92.63,35.48 94.37,33.74 Q1.3
  Top 0.5: K2.8 88.4,41.94 D2.A
N$31
  Top 0.3: Q1.6 107.07,32.14 109.14,34.21 109.14,39.29 107.87,40.56 107.87,41.91 K1.8
  Top 0.5: K1.8 104.91,41.94 D1.A
N$32  (via drill 0.35)
  Top 0.3: Q2.3 86.93,32.32 v87.55,32.94 | v100.89,38.02 100.89,49.66 103.74,52.52 D4.A
  Top 0.5: K4.8 104.91,53.37 D4.A
  Bottom 0.3: v87.55,32.94 95.81,32.94 v100.89,38.02
N$33
  Top 0.3: Q5.6 102.46,65.31 102.79,65.64 102.79,69.14 101.52,70.41 X5.3
N$34
  Top 0.3: Q5.3 103.91,66.61 104.06,66.76 X5.4
N$35
  Top 0.3: Q6.6 107.54,65.31 107.87,65.64 107.87,69.14 106.6,70.41 X5.5
N$36
  Top 0.3: Q6.3 108.99,66.61 109.14,66.76 X5.6
OV  (via drill 0.35)
  other vias: 19.92,34.21
SHIELD  (3 unrouted)

### Text on the board
tPlace: Raspberry Pi / Selecta Shield | Timo Wiedmer | January 2022 | BZU